# Altium schematic sheet as14120_fpga_power_conf.SchDoc
size A3
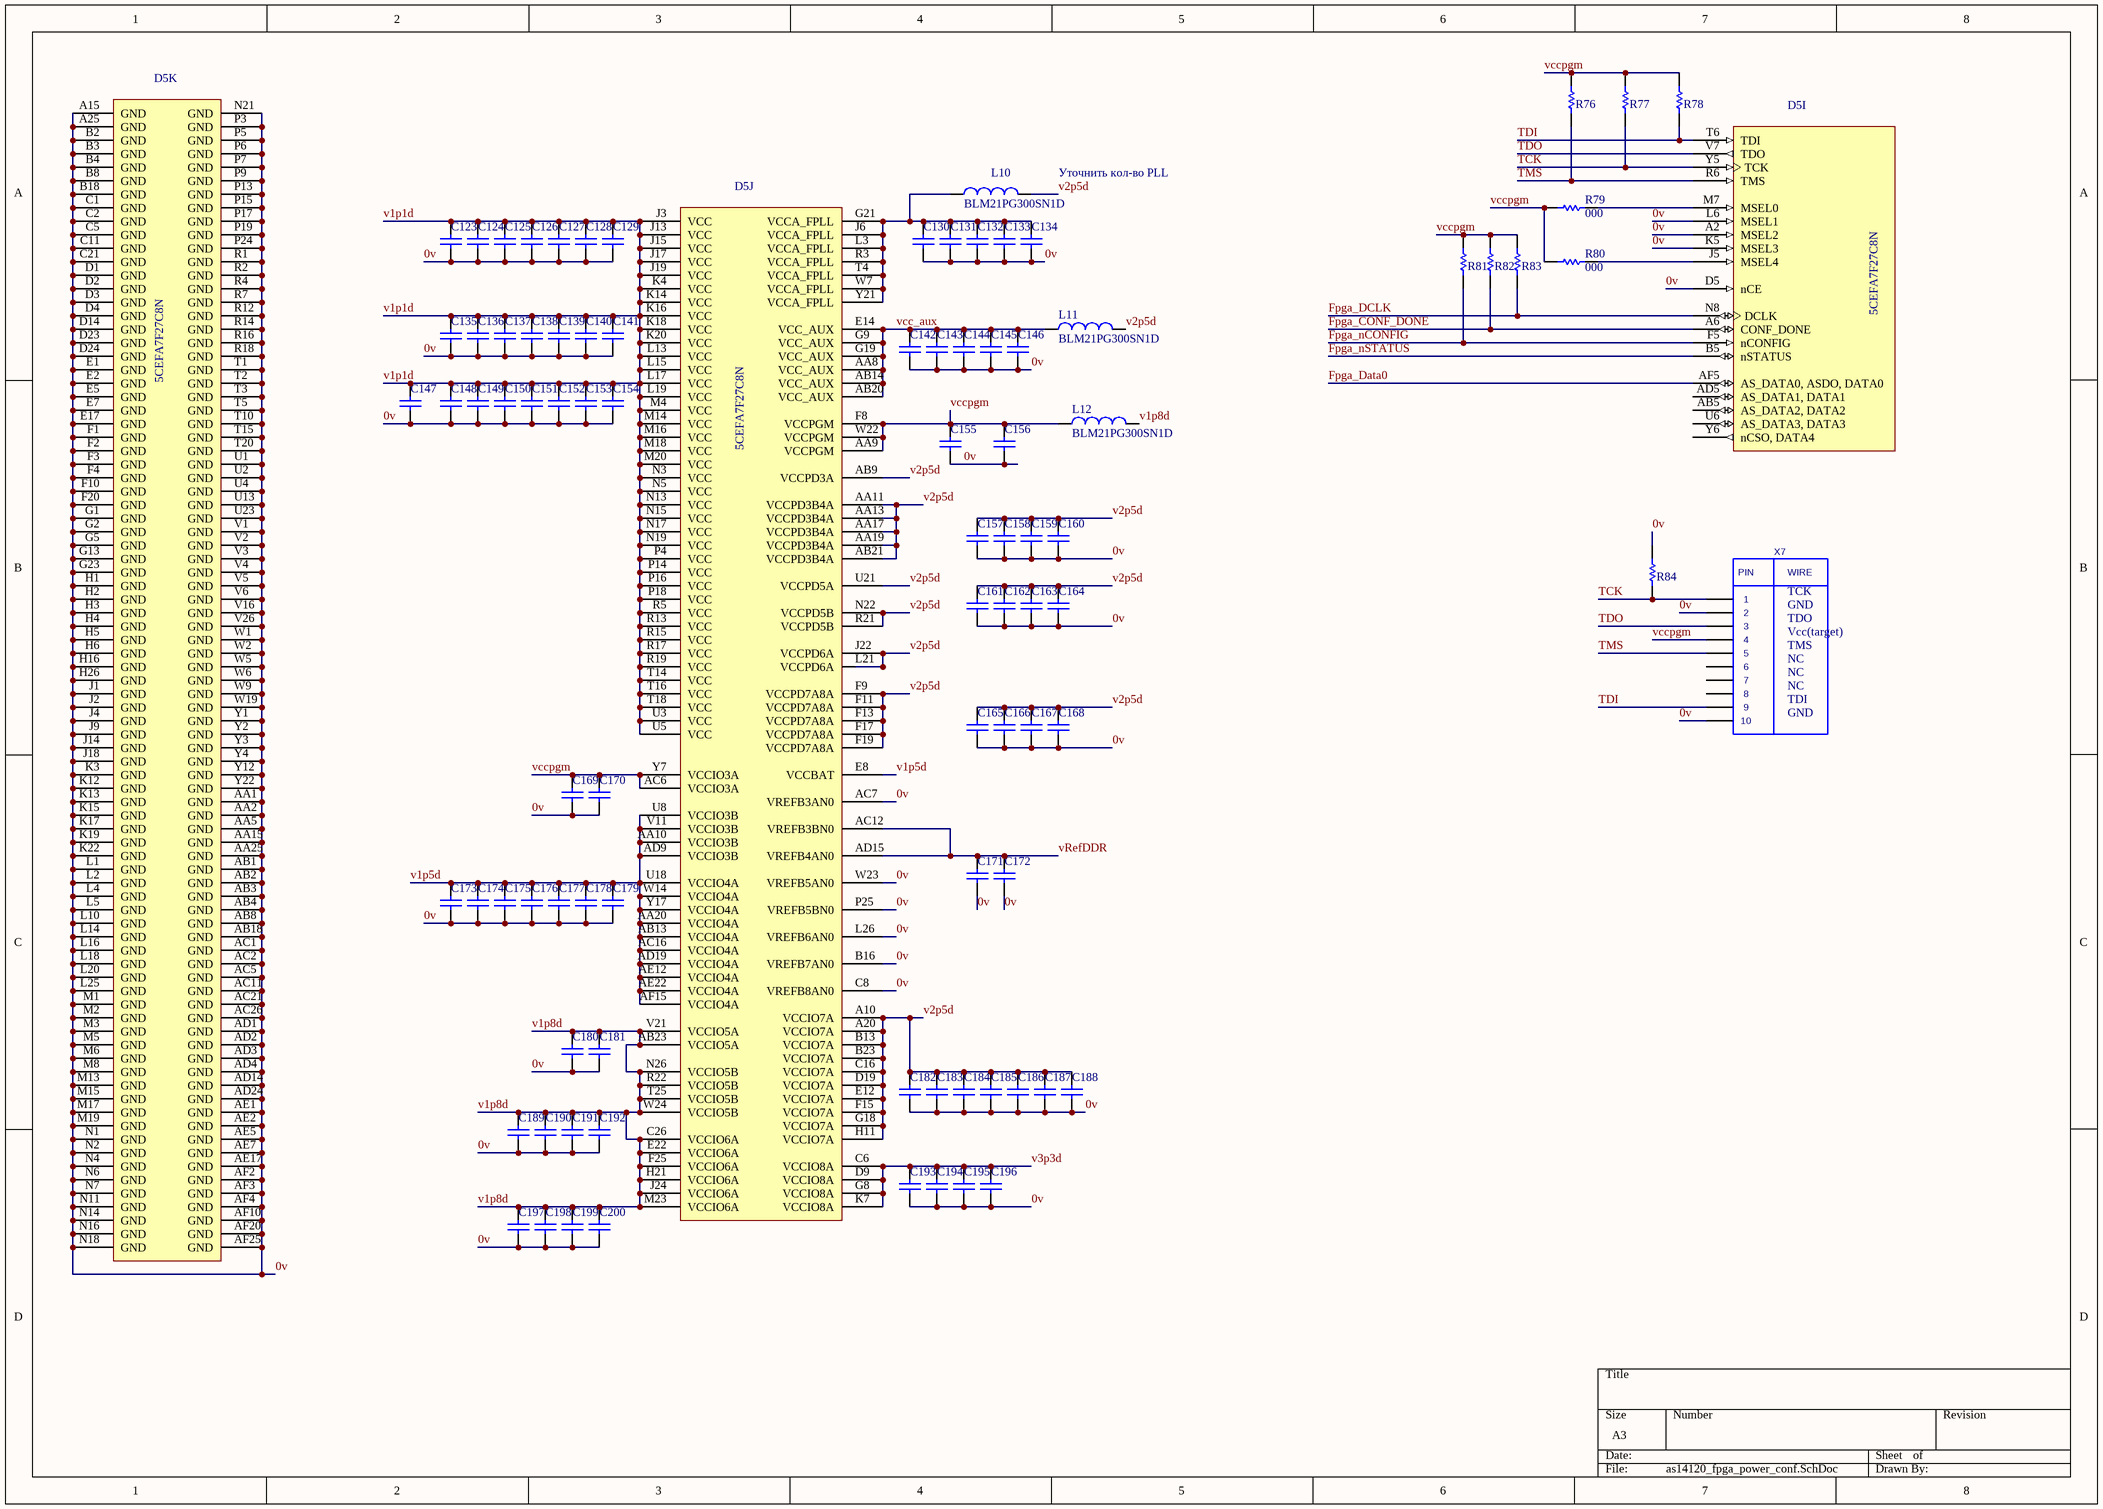
[diagram p0: as14120_fpga_power_conf.SchDoc]

## Parts
C123  CAP 1uF 10V 0402(1005)  [CAPC0402(1005)60_M]  (value not drawn)
C124  CAP 1uF 10V 0402(1005)  [CAPC0402(1005)60_M]  (value not drawn)
C125  CAP 1uF 10V 0402(1005)  [CAPC0402(1005)60_M]  (value not drawn)
C126  CAP 1uF 10V 0402(1005)  [CAPC0402(1005)60_M]  (value not drawn)
C127  CAP 1uF 10V 0402(1005)  [CAPC0402(1005)60_M]  (value not drawn)
C128  CAP 1uF 10V 0402(1005)  [CAPC0402(1005)60_M]  (value not drawn)
C129  CAP 1uF 10V 0402(1005)  [CAPC0402(1005)60_M]  (value not drawn)
C130  CAP 1uF 10V 0402(1005)  [CAPC0402(1005)60_M]  (value not drawn)
C131  CAP 1uF 10V 0402(1005)  [CAPC0402(1005)60_M]  (value not drawn)
C132  CAP 1uF 10V 0402(1005)  [CAPC0402(1005)60_M]  (value not drawn)
C133  CAP 1uF 10V 0402(1005)  [CAPC0402(1005)60_M]  (value not drawn)
C134  CAP 1uF 10V 0402(1005)  [CAPC0402(1005)60_M]  (value not drawn)
C135  CAP 1uF 10V 0402(1005)  [CAPC0402(1005)60_M]  (value not drawn)
C136  CAP 1uF 10V 0402(1005)  [CAPC0402(1005)60_M]  (value not drawn)
C137  CAP 1uF 10V 0402(1005)  [CAPC0402(1005)60_M]  (value not drawn)
C138  CAP 1uF 10V 0402(1005)  [CAPC0402(1005)60_M]  (value not drawn)
C139  CAP 1uF 10V 0402(1005)  [CAPC0402(1005)60_M]  (value not drawn)
C140  CAP 1uF 10V 0402(1005)  [CAPC0402(1005)60_M]  (value not drawn)
C141  CAP 1uF 10V 0402(1005)  [CAPC0402(1005)60_M]  (value not drawn)
C142  CAP 1uF 10V 0402(1005)  [CAPC0402(1005)60_M]  (value not drawn)
C143  CAP 1uF 10V 0402(1005)  [CAPC0402(1005)60_M]  (value not drawn)
C144  CAP 1uF 10V 0402(1005)  [CAPC0402(1005)60_M]  (value not drawn)
C145  CAP 1uF 10V 0402(1005)  [CAPC0402(1005)60_M]  (value not drawn)
C146  CAP 1uF 10V 0402(1005)  [CAPC0402(1005)60_M]  (value not drawn)
C147  CAP 1uF 10V 0402(1005)  [CAPC0402(1005)60_M]  (value not drawn)
C148  CAP 1uF 10V 0402(1005)  [CAPC0402(1005)60_M]  (value not drawn)
C149  CAP 1uF 10V 0402(1005)  [CAPC0402(1005)60_M]  (value not drawn)
C150  CAP 1uF 10V 0402(1005)  [CAPC0402(1005)60_M]  (value not drawn)
C151  CAP 1uF 10V 0402(1005)  [CAPC0402(1005)60_M]  (value not drawn)
C152  CAP 1uF 10V 0402(1005)  [CAPC0402(1005)60_M]  (value not drawn)
C153  CAP 1uF 10V 0402(1005)  [CAPC0402(1005)60_M]  (value not drawn)
C154  CAP 1uF 10V 0402(1005)  [CAPC0402(1005)60_M]  (value not drawn)
C155  CAP 1uF 10V 0402(1005)  [CAPC0402(1005)60_M]  (value not drawn)
C156  CAP 1uF 10V 0402(1005)  [CAPC0402(1005)60_M]  (value not drawn)
C157  CAP 1uF 10V 0402(1005)  [CAPC0402(1005)60_M]  (value not drawn)
C158  CAP 1uF 10V 0402(1005)  [CAPC0402(1005)60_M]  (value not drawn)
C159  CAP 1uF 10V 0402(1005)  [CAPC0402(1005)60_M]  (value not drawn)
C160  CAP 1uF 10V 0402(1005)  [CAPC0402(1005)60_M]  (value not drawn)
C161  CAP 1uF 10V 0402(1005)  [CAPC0402(1005)60_M]  (value not drawn)
C162  CAP 1uF 10V 0402(1005)  [CAPC0402(1005)60_M]  (value not drawn)
C163  CAP 1uF 10V 0402(1005)  [CAPC0402(1005)60_M]  (value not drawn)
C164  CAP 1uF 10V 0402(1005)  [CAPC0402(1005)60_M]  (value not drawn)
C165  CAP 1uF 10V 0402(1005)  [CAPC0402(1005)60_M]  (value not drawn)
C166  CAP 1uF 10V 0402(1005)  [CAPC0402(1005)60_M]  (value not drawn)
C167  CAP 1uF 10V 0402(1005)  [CAPC0402(1005)60_M]  (value not drawn)
C168  CAP 1uF 10V 0402(1005)  [CAPC0402(1005)60_M]  (value not drawn)
C169  CAP 1uF 10V 0402(1005)  [CAPC0402(1005)60_M]  (value not drawn)
C170  CAP 1uF 10V 0402(1005)  [CAPC0402(1005)60_M]  (value not drawn)
C171  CAP 1uF 10V 0402(1005)  [CAPC0402(1005)60_M]  (value not drawn)
C172  CAP 1uF 10V 0402(1005)  [CAPC0402(1005)60_M]  (value not drawn)
C173  CAP 1uF 10V 0402(1005)  [CAPC0402(1005)60_M]  (value not drawn)
C174  CAP 1uF 10V 0402(1005)  [CAPC0402(1005)60_M]  (value not drawn)
C175  CAP 1uF 10V 0402(1005)  [CAPC0402(1005)60_M]  (value not drawn)
C176  CAP 1uF 10V 0402(1005)  [CAPC0402(1005)60_M]  (value not drawn)
C177  CAP 1uF 10V 0402(1005)  [CAPC0402(1005)60_M]  (value not drawn)
C178  CAP 1uF 10V 0402(1005)  [CAPC0402(1005)60_M]  (value not drawn)
C179  CAP 1uF 10V 0402(1005)  [CAPC0402(1005)60_M]  (value not drawn)
C180  CAP 1uF 10V 0402(1005)  [CAPC0402(1005)60_M]  (value not drawn)
C181  CAP 1uF 10V 0402(1005)  [CAPC0402(1005)60_M]  (value not drawn)
C182  CAP 1uF 10V 0402(1005)  [CAPC0402(1005)60_M]  (value not drawn)
C183  CAP 1uF 10V 0402(1005)  [CAPC0402(1005)60_M]  (value not drawn)
C184  CAP 1uF 10V 0402(1005)  [CAPC0402(1005)60_M]  (value not drawn)
C185  CAP 1uF 10V 0402(1005)  [CAPC0402(1005)60_M]  (value not drawn)
C186  CAP 1uF 10V 0402(1005)  [CAPC0402(1005)60_M]  (value not drawn)
C187  CAP 1uF 10V 0402(1005)  [CAPC0402(1005)60_M]  (value not drawn)
C188  CAP 1uF 10V 0402(1005)  [CAPC0402(1005)60_M]  (value not drawn)
C189  CAP 1uF 10V 0402(1005)  [CAPC0402(1005)60_M]  (value not drawn)
C190  CAP 1uF 10V 0402(1005)  [CAPC0402(1005)60_M]  (value not drawn)
C191  CAP 1uF 10V 0402(1005)  [CAPC0402(1005)60_M]  (value not drawn)
C192  CAP 1uF 10V 0402(1005)  [CAPC0402(1005)60_M]  (value not drawn)
C193  CAP 1uF 10V 0402(1005)  [CAPC0402(1005)60_M]  (value not drawn)
C194  CAP 1uF 10V 0402(1005)  [CAPC0402(1005)60_M]  (value not drawn)
C195  CAP 1uF 10V 0402(1005)  [CAPC0402(1005)60_M]  (value not drawn)
C196  CAP 1uF 10V 0402(1005)  [CAPC0402(1005)60_M]  (value not drawn)
C197  CAP 1uF 10V 0402(1005)  [CAPC0402(1005)60_M]  (value not drawn)
C198  CAP 1uF 10V 0402(1005)  [CAPC0402(1005)60_M]  (value not drawn)
C199  CAP 1uF 10V 0402(1005)  [CAPC0402(1005)60_M]  (value not drawn)
C200  CAP 1uF 10V 0402(1005)  [CAPC0402(1005)60_M]  (value not drawn)
D5  5CEFA7F27C8N  [ALTR-672-FBGA-2000A]  (parts I,J,K of 12)
L10  BLM21PG300SN1D  [CAPC0805(2012)100_N]
L11  BLM21PG300SN1D  [CAPC0805(2012)100_N]
L12  BLM21PG300SN1D  [CAPC0805(2012)100_N]
R76  1K 5% 0603(1608)  [RESC0603(1608)_L]  (value not drawn)
R77  1K 5% 0603(1608)  [RESC0603(1608)_L]  (value not drawn)
R78  1K 5% 0603(1608)  [RESC0603(1608)_L]  (value not drawn)
R79  value 000  [RESC0603(1608)_L]  (hidden comment: 1K 5% 0603(1608))
R80  value 000  [RESC0603(1608)_L]  (hidden comment: 1K 5% 0603(1608))
R81  1K 5% 0603(1608)  [RESC0603(1608)_L]  (value not drawn)
R82  1K 5% 0603(1608)  [RESC0603(1608)_L]  (value not drawn)
R83  1K 5% 0603(1608)  [RESC0603(1608)_L]  (value not drawn)
R84  1K 5% 0603(1608)  [RESC0603(1608)_L]  (value not drawn)
X7  IDC10  [IDC10M]  (value not drawn)

## Nets
0v: C123.1 C124.1 C125.1 C126.1 C127.1 C128.1 C129.1 C130.1 C131.1 C132.1 C133.1 C134.1 C135.1 C136.1 C137.1 C138.1 C139.1 C140.1 C141.1 C142.1 C143.1 C144.1 C145.1 C146.1 C147.1 C148.1 C149.1 C150.1 C151.1 C152.1 C153.1 C154.1 C155.1 C156.1 C157.1 C158.1 C159.1 C160.1 C161.1 C162.1 C163.1 C164.1 C165.1 C166.1 C167.1 C168.1 C169.1 C170.1 C171.1 C172.1 C173.1 C174.1 C175.1 C176.1 C177.1 C178.1 C179.1 C180.1 C181.1 C182.1 C183.1 C184.1 C185.1 C186.1 C187.1 C188.1 C189.1 C190.1 C191.1 C192.1 C193.1 C194.1 C195.1 C196.1 C197.1 C198.1 C199.1 C200.1 D5.A2(MSEL2) D5.A15(GND) D5.A25(GND) D5.AA1(GND) D5.AA2(GND) D5.AA5(GND) D5.AA15(GND) D5.AA25(GND) D5.AB1(GND) D5.AB2(GND) D5.AB3(GND) D5.AB4(GND) D5.AB8(GND) D5.AB18(GND) D5.AC1(GND) D5.AC2(GND) D5.AC5(GND) D5.AC7(VREFB3AN0) D5.AC11(GND) D5.AC21(GND) D5.AC26(GND) D5.AD1(GND) D5.AD2(GND) D5.AD3(GND) D5.AD4(GND) D5.AD14(GND) D5.AD24(GND) D5.AE1(GND) D5.AE2(GND) D5.AE5(GND) D5.AE7(GND) D5.AE17(GND) D5.AF2(GND) D5.AF3(GND) D5.AF4(GND) D5.AF10(GND) D5.AF20(GND) D5.AF25(GND) D5.B2(GND) D5.B3(GND) D5.B4(GND) D5.B8(GND) D5.B16(VREFB7AN0) D5.B18(GND) D5.C1(GND) D5.C2(GND) D5.C5(GND) D5.C8(VREFB8AN0) D5.C11(GND) D5.C21(GND) D5.D1(GND) D5.D2(GND) D5.D3(GND) D5.D4(GND) D5.D5(nCE) D5.D14(GND) D5.D23(GND) D5.D24(GND) D5.E1(GND) D5.E2(GND) D5.E5(GND) D5.E7(GND) D5.E17(GND) D5.F1(GND) D5.F2(GND) D5.F3(GND) D5.F4(GND) D5.F10(GND) D5.F20(GND) D5.G1(GND) D5.G2(GND) D5.G5(GND) D5.G13(GND) D5.G23(GND) D5.H1(GND) D5.H2(GND) D5.H3(GND) D5.H4(GND) D5.H5(GND) D5.H6(GND) D5.H16(GND) D5.H26(GND) D5.J1(GND) D5.J2(GND) D5.J4(GND) D5.J9(GND) D5.J14(GND) D5.J18(GND) D5.K3(GND) D5.K5(MSEL3) D5.K12(GND) D5.K13(GND) D5.K15(GND) D5.K17(GND) D5.K19(GND) D5.K22(GND) D5.L1(GND) D5.L2(GND) D5.L4(GND) D5.L5(GND) D5.L6(MSEL1) D5.L10(GND) D5.L14(GND) D5.L16(GND) D5.L18(GND) D5.L20(GND) D5.L25(GND) D5.L26(VREFB6AN0) D5.M1(GND) D5.M2(GND) D5.M3(GND) D5.M5(GND) D5.M6(GND) D5.M8(GND) D5.M13(GND) D5.M15(GND) D5.M17(GND) D5.M19(GND) D5.N1(GND) D5.N2(GND) D5.N4(GND) D5.N6(GND) D5.N7(GND) D5.N11(GND) D5.N14(GND) D5.N16(GND) D5.N18(GND) D5.N21(GND) D5.P3(GND) D5.P5(GND) D5.P6(GND) D5.P7(GND) D5.P9(GND) D5.P13(GND) D5.P15(GND) D5.P17(GND) D5.P19(GND) D5.P24(GND) D5.P25(VREFB5BN0) D5.R1(GND) D5.R2(GND) D5.R4(GND) D5.R7(GND) D5.R12(GND) D5.R14(GND) D5.R16(GND) D5.R18(GND) D5.T1(GND) D5.T2(GND) D5.T3(GND) D5.T5(GND) D5.T10(GND) D5.T15(GND) D5.T20(GND) D5.U1(GND) D5.U2(GND) D5.U4(GND) D5.U13(GND) D5.U23(GND) D5.V1(GND) D5.V2(GND) D5.V3(GND) D5.V4(GND) D5.V5(GND) D5.V6(GND) D5.V16(GND) D5.V26(GND) D5.W1(GND) D5.W2(GND) D5.W5(GND) D5.W6(GND) D5.W9(GND) D5.W19(GND) D5.W23(VREFB5AN0) D5.Y1(GND) D5.Y2(GND) D5.Y3(GND) D5.Y4(GND) D5.Y12(GND) D5.Y22(GND) R84.1 X7.2 X7.10
Fpga_CONF_DONE: D5.A6(CONF_DONE) R82.2
Fpga_Data0: D5.AF5(AS_DATA0,_ASDO,_DATA0)
Fpga_DCLK: D5.N8(DCLK) R83.2
Fpga_nCONFIG: D5.F5(nCONFIG) R81.2
Fpga_nSTATUS: D5.B5(nSTATUS)
TCK: D5.Y5(TCK) R77.2 R84.2 X7.1
TDI: D5.T6(TDI) R78.1 X7.9
TDO: D5.V7(TDO) X7.3
TMS: D5.R6(TMS) R76.2 X7.5
v1p1d: C123.2 C124.2 C125.2 C126.2 C127.2 C128.2 C129.2 C135.2 C136.2 C137.2 C138.2 C139.2 C140.2 C141.2 C147.2 C148.2 C149.2 C150.2 C151.2 C152.2 C153.2 C154.2 D5.J3(VCC) D5.J13(VCC) D5.J15(VCC) D5.J17(VCC) D5.J19(VCC) D5.K4(VCC) D5.K14(VCC) D5.K16(VCC) D5.K18(VCC) D5.K20(VCC) D5.L13(VCC) D5.L15(VCC) D5.L17(VCC) D5.L19(VCC) D5.M4(VCC) D5.M14(VCC) D5.M16(VCC) D5.M18(VCC) D5.M20(VCC) D5.N3(VCC) D5.N5(VCC) D5.N13(VCC) D5.N15(VCC) D5.N17(VCC) D5.N19(VCC) D5.P4(VCC) D5.P14(VCC) D5.P16(VCC) D5.P18(VCC) D5.R5(VCC) D5.R13(VCC) D5.R15(VCC) D5.R17(VCC) D5.R19(VCC) D5.T14(VCC) D5.T16(VCC) D5.T18(VCC) D5.U3(VCC) D5.U5(VCC)
v1p5d: C173.2 C174.2 C175.2 C176.2 C177.2 C178.2 C179.2 D5.AA10(VCCIO3B) D5.AA20(VCCIO4A) D5.AB13(VCCIO4A) D5.AC16(VCCIO4A) D5.AD9(VCCIO3B) D5.AD19(VCCIO4A) D5.AE12(VCCIO4A) D5.AE22(VCCIO4A) D5.AF15(VCCIO4A) D5.E8(VCCBAT) D5.U8(VCCIO3B) D5.U18(VCCIO4A) D5.V11(VCCIO3B) D5.W14(VCCIO4A) D5.Y17(VCCIO4A)
v1p8d: C180.2 C181.2 C189.2 C190.2 C191.2 C192.2 C197.2 C198.2 C199.2 C200.2 D5.AB23(VCCIO5A) D5.C26(VCCIO6A) D5.E22(VCCIO6A) D5.F25(VCCIO6A) D5.H21(VCCIO6A) D5.J24(VCCIO6A) D5.M23(VCCIO6A) D5.N26(VCCIO5B) D5.R22(VCCIO5B) D5.T25(VCCIO5B) D5.V21(VCCIO5A) D5.W24(VCCIO5B) L12.2
v2p5d: C157.2 C158.2 C159.2 C160.2 C161.2 C162.2 C163.2 C164.2 C165.2 C166.2 C167.2 C168.2 C182.2 C183.2 C184.2 C185.2 C186.2 C187.2 C188.2 D5.A10(VCCIO7A) D5.A20(VCCIO7A) D5.AA11(VCCPD3B4A) D5.AA13(VCCPD3B4A) D5.AA17(VCCPD3B4A) D5.AA19(VCCPD3B4A) D5.AB9(VCCPD3A) D5.AB21(VCCPD3B4A) D5.B13(VCCIO7A) D5.B23(VCCIO7A) D5.C16(VCCIO7A) D5.D19(VCCIO7A) D5.E12(VCCIO7A) D5.F9(VCCPD7A8A) D5.F11(VCCPD7A8A) D5.F13(VCCPD7A8A) D5.F15(VCCIO7A) D5.F17(VCCPD7A8A) D5.F19(VCCPD7A8A) D5.G18(VCCIO7A) D5.H11(VCCIO7A) D5.J22(VCCPD6A) D5.L21(VCCPD6A) D5.N22(VCCPD5B) D5.R21(VCCPD5B) D5.U21(VCCPD5A) L10.2 L11.2
v3p3d: C193.2 C194.2 C195.2 C196.2 D5.C6(VCCIO8A) D5.D9(VCCIO8A) D5.G8(VCCIO8A) D5.K7(VCCIO8A)
vcc_aux: C142.2 C143.2 C144.2 C145.2 C146.2 D5.AA8(VCC_AUX) D5.AB14(VCC_AUX) D5.AB20(VCC_AUX) D5.E14(VCC_AUX) D5.G9(VCC_AUX) D5.G19(VCC_AUX) L11.1
vccpgm: C155.2 C156.2 C169.2 C170.2 D5.AA9(VCCPGM) D5.AC6(VCCIO3A) D5.F8(VCCPGM) D5.W22(VCCPGM) D5.Y7(VCCIO3A) L12.1 R76.1 R77.1 R78.2 R79.2 R80.2 R81.1 R82.1 R83.1 X7.4
vRefDDR: C171.2 C172.2 D5.AC12(VREFB3BN0) D5.AD15(VREFB4AN0)
NetC130_2: C130.2 C131.2 C132.2 C133.2 C134.2 D5.G21(VCCA_FPLL) D5.J6(VCCA_FPLL) D5.L3(VCCA_FPLL) D5.R3(VCCA_FPLL) D5.T4(VCCA_FPLL) D5.W7(VCCA_FPLL) D5.Y21(VCCA_FPLL) L10.1
NetD5_J5: D5.J5(MSEL4) R80.1
NetD5_M7: D5.M7(MSEL0) R79.1

Not connected (* = marked no-connect by the designer): D5 AB5(AS_DATA2,_DATA2) AD5(AS_DATA1,_DATA1) U6(AS_DATA3,_DATA3) Y6(nCSO,_DATA4); X7 6 7 8

## Notes on the sheet
- Уточнить кол-во PLL
- TCK
- GND
- TDO
- Vcc(target)
- TMS
- NC
- TDI
- (in symbol IDC10) PIN; WIRE

## Library data of the parts
C123-C200 = CAP_0402: CAP 1uF 10V ±20% 0402 (1005 Metric) Thickness 0.6mm SMD; Case-Metric: 1005; Case-EIA: 0402; Value: 0.1; Tolerance: ±20%; Max Thickness: 0.6 mm; Rated Voltage: 10 V; Technology: SMT
D5 = 5CEFA7F27C8N: Cyclone V E Family FPGA, 1.07 to 1.13 V Supply, 336 I/O Pins, 7 PLLs, 672-Pin FBGA, Speed Grade 8, Commercial Grade, RoHS Compliant; Manufacturer: Altera; Device Group: 5CEFA7; GPIO: 336; Logic Elements (LE) (K): 149.5; Speed Grade: 8; DatasheetVersion: Rev. 3.1; PackageReference: 672-FBGA-2000A; PackageDescription: 672-Pin FineLine Ball-Grid Array (FBGA), Body 27 x 27 mm, Pitch 1 mm; Supplier 1: Digi-Key; Supplier Part Number 1: 5CEFA7F27C8N-ND; Supplier 2: Mouser; Supplier Part Number 2: 989-5CEFA7F27C8N; RoHS: RoHS Compliant; Subcategory: Cyclone V E; Voltage Supply: 1.07 to 1.13 V; Mounting Technology: Surface Mount; Code_JEDEC: MS-034-AAL-1; PartNumber: 5CEFA7F27C8N; ComponentLink1Description: Manufacturer URL; ComponentLink1URL: http://www.altera.com; ComponentLink2Description: Datasheet; ComponentLink2URL: http://www.altera.com/literature/hb/cyclone-v/cv_51002.pdf; ComponentLink3Description: Package Specification; ComponentLink3URL: http://www.altera.com/devicepackaging/04R00427-01.pdf; ComponentLink4Description: Device Handbook URL; ComponentLink4URL: http://www.altera.com/literature/hb/cyclone-v/cyclone5_handbook.pdf; ComponentLink5Description: Device Overview URL; ComponentLink5URL: http://www.altera.com/literature/hb/cyclone-v/cv_51001.pdf; ComponentLink6Description: Device Pin-Out URL; ComponentLink6URL: http://www.altera.com/literature/dp/cyclone-v/1.1.txt; ComponentLink7Description: Product URL; ComponentLink7URL: http://www.buyaltera.com/scripts/partsearch.dll?Detail&name=5CEFA7F27C8N-ND
L10-L12 = Ferrite_beat
R76-R78 R81-R83 = RES_0603: 1K 0.1W 5% 0603 (1608 Metric)  SMD; Case-EIA: 0603; Case-Metric: 1608; Value: 10k; Technology: SMT; Tolerance: 5 %; Power: 0.1 W
R79 R80 R84 = RES_0603: 1K 0.1W 5% 0603 (1608 Metric)  SMD; Case-EIA: 0603; Case-Metric: 1608; Technology: SMT; Tolerance: 5 %; Power: 0.1 W
  R84: Value: 1k
X7 = IDC10: Value: *